# EAGLE schematic esp_teensy_bridge (EAGLE 9.6.2)
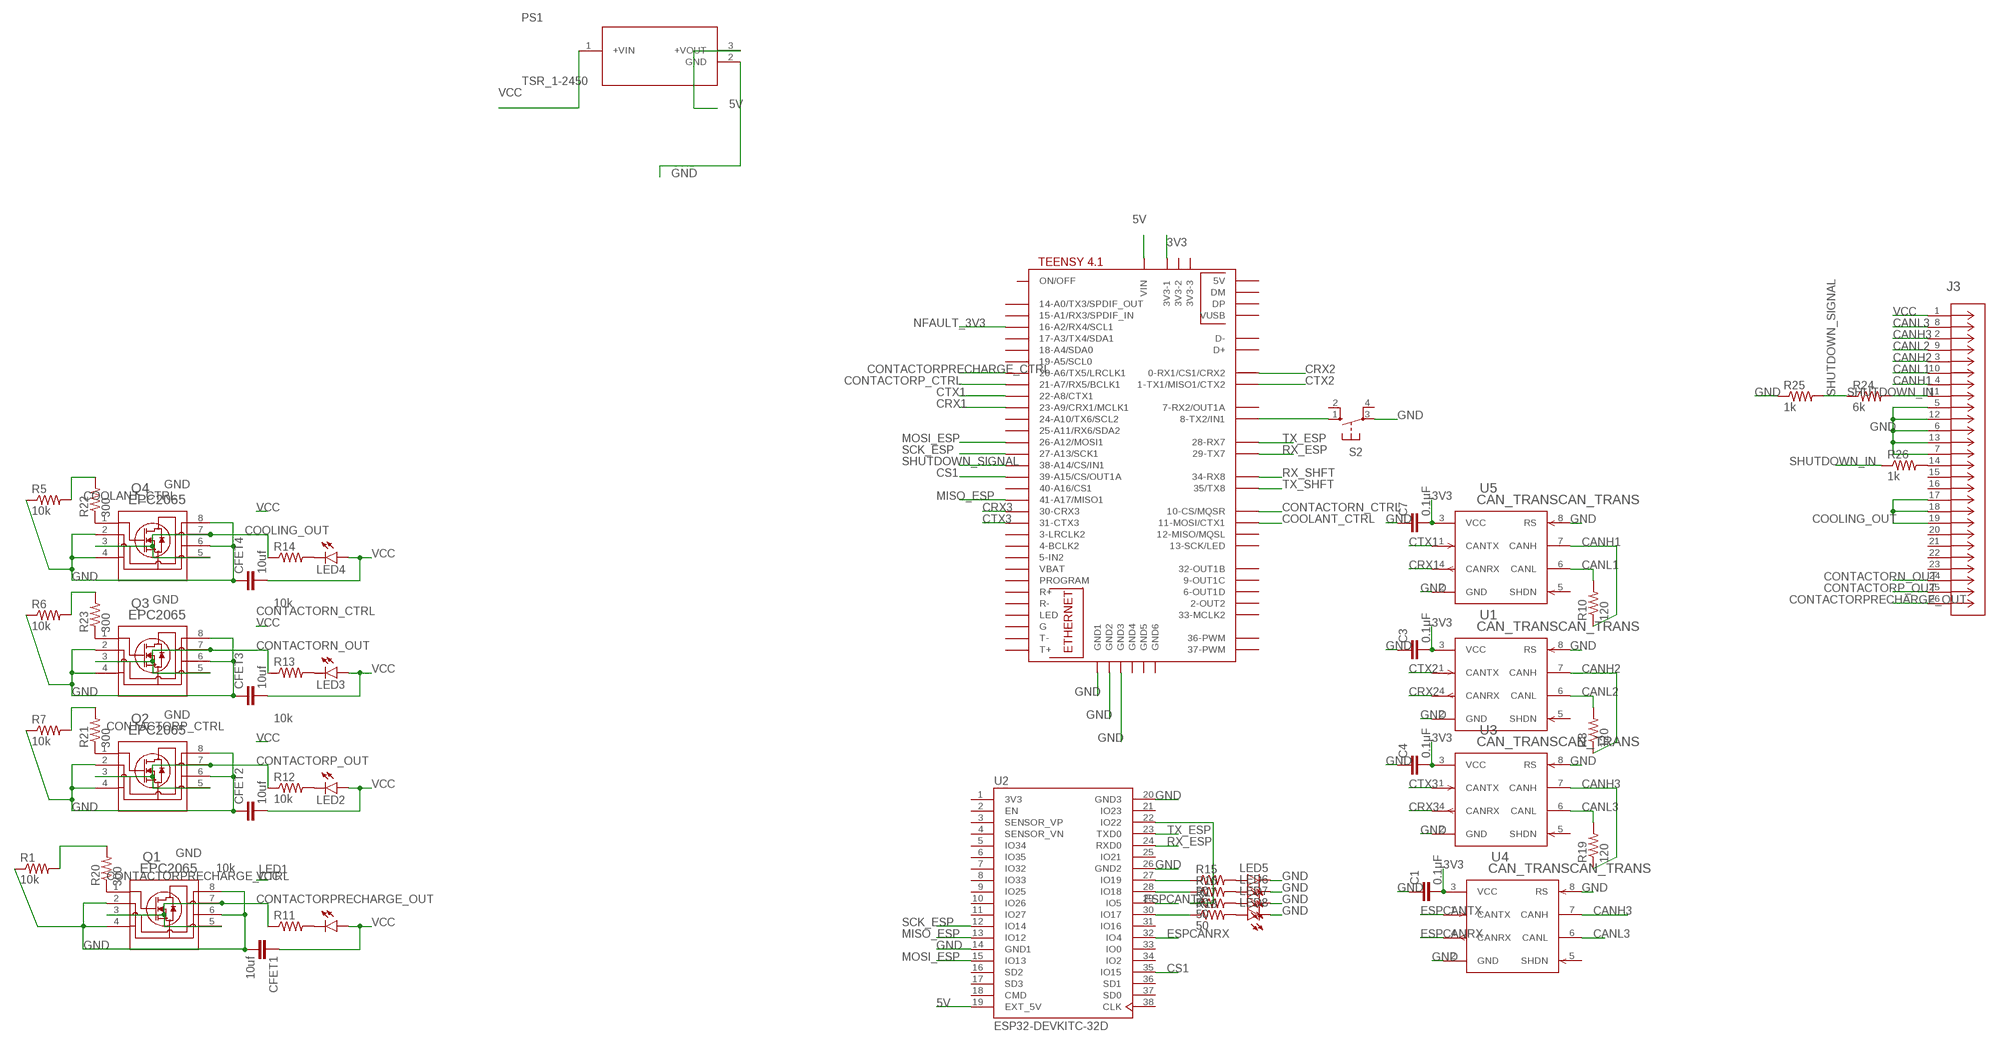
[diagram p0: schematic, sheet 1, part 1 of 2]
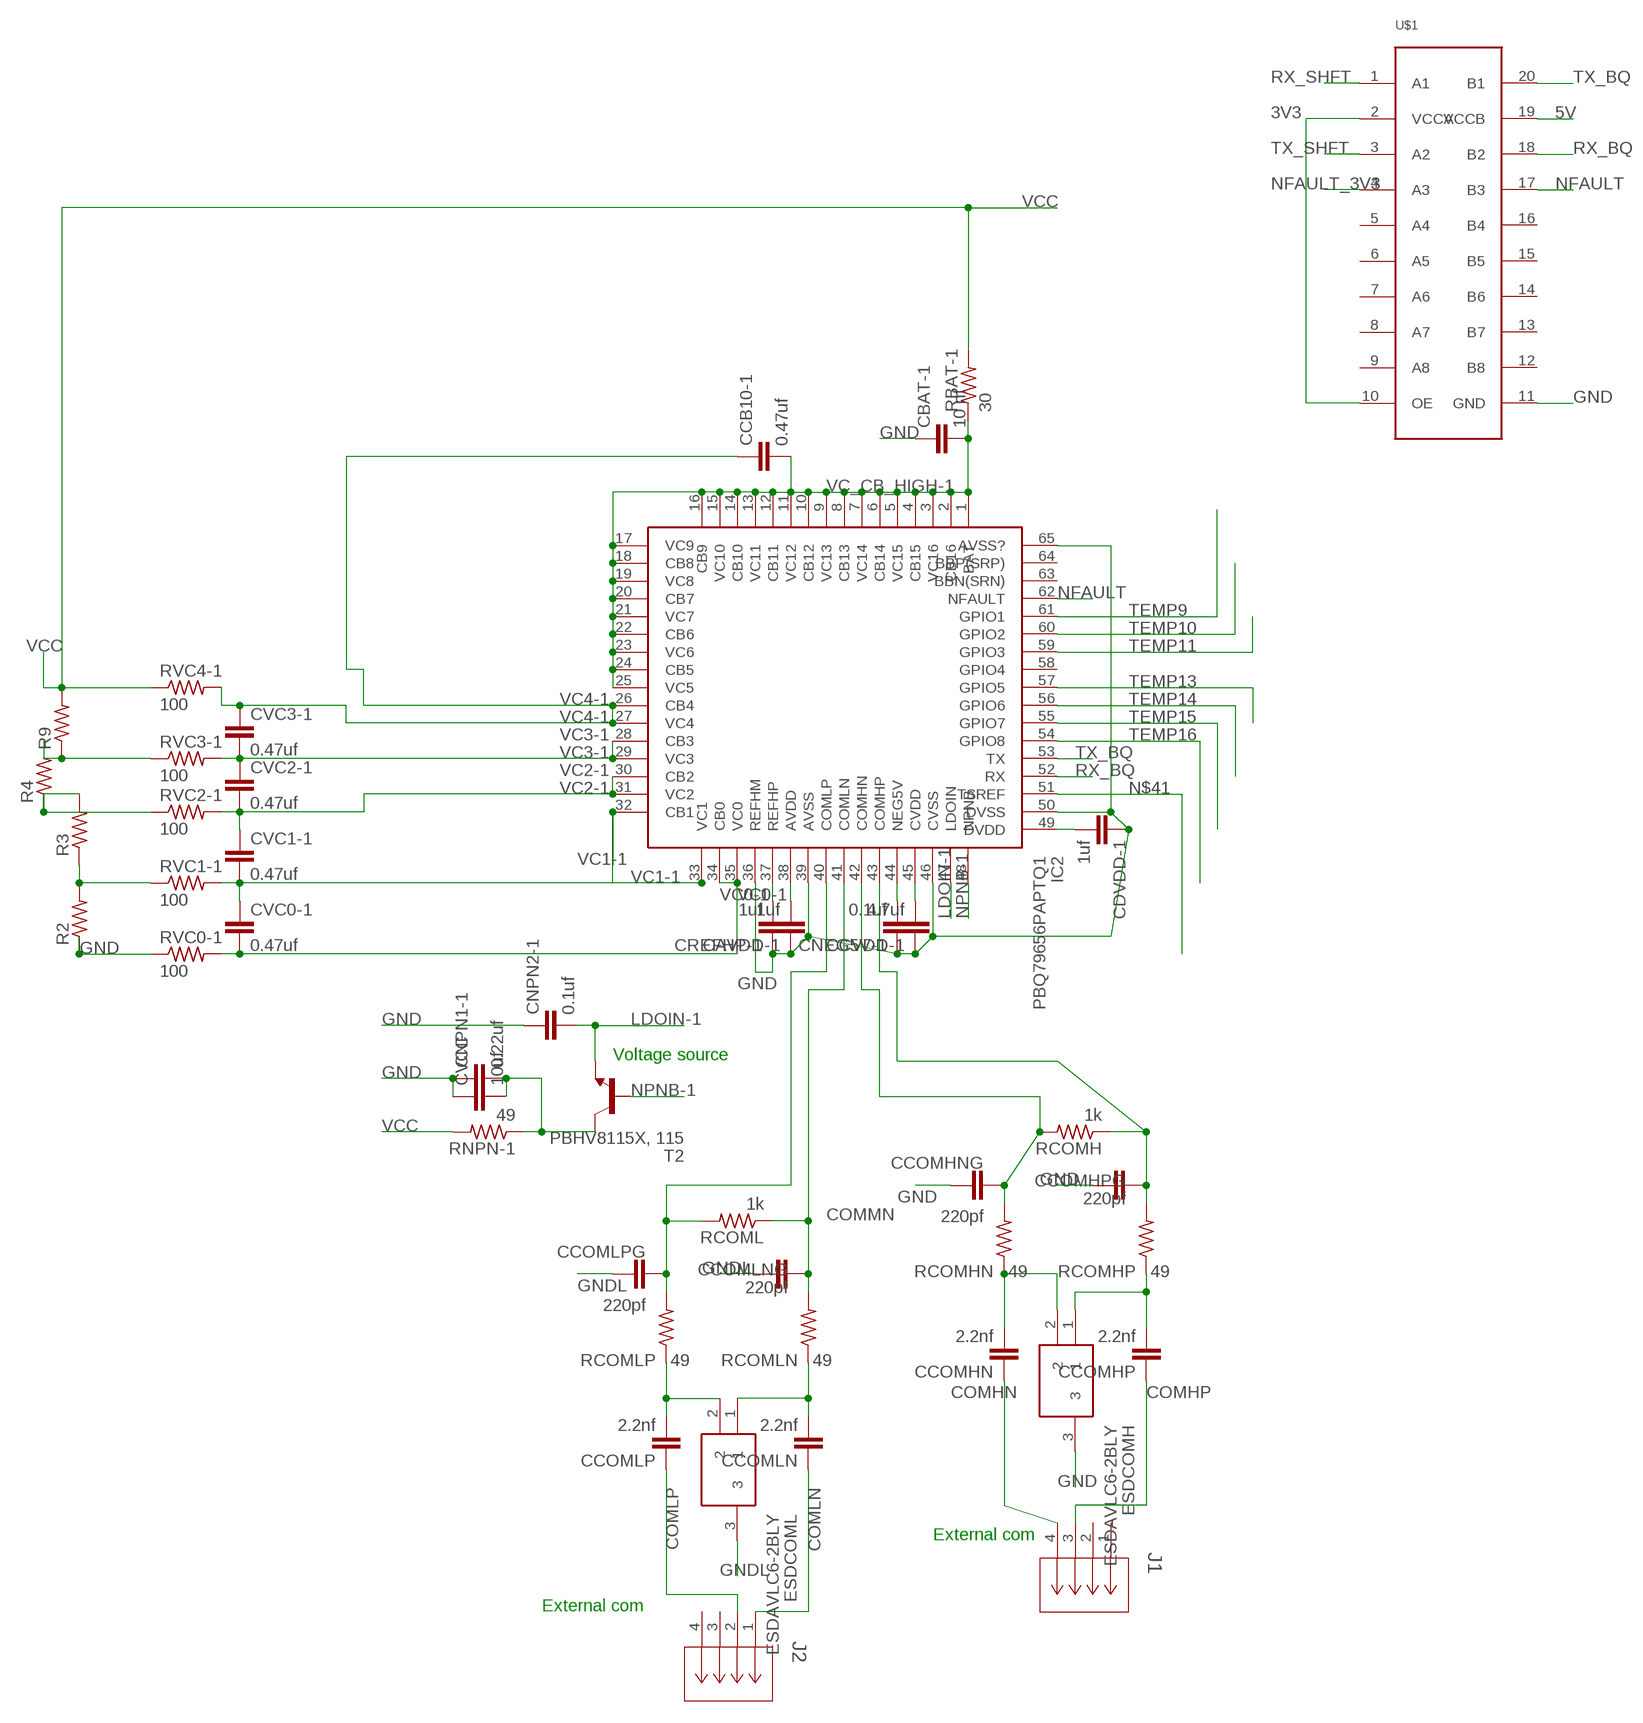
[diagram p1: schematic, sheet 1, part 2 of 2]

## Parts
C1  0.1μF  C-EUC0603  [C0603]
C3  0.1μF  C-EUC0603  [C0603]
C4  0.1μF  C-EUC0603  [C0603]
C7  0.1μF  C-EUC0603  [C0603]
CAVDD-1  1uf  C-EUC0603  [C0603]
CBAT-1  10 nf  C-EUC0603  [C0603]
CCB10-1  0.47uf  C-EUC0603  [C0603]
CCOMHN  2.2nf  C-EU075-032X103  [C075-032X103]
CCOMHNG  220pf  C-EUC0603  [C0603]
CCOMHP  2.2nf  C-EU075-032X103  [C075-032X103]
CCOMHPG  220pf  C-EUC0603  [C0603]
CCOMLN  2.2nf  C-EU075-032X103  [C075-032X103]
CCOMLNG  220pf  C-EUC0603  [C0603]
CCOMLP  2.2nf  C-EU075-032X103  [C075-032X103]
CCOMLPG  220pf  C-EUC0603  [C0603]
CCVDD-1  4.7uf  C-EUC0603  [C0603]
CDVDD-1  1uf  C-EUC0603  [C0603]
CFET1  10uf  C-EUC0805  [C0805]
CFET2  10uf  C-EUC0805  [C0805]
CFET3  10uf  C-EUC0805  [C0805]
CFET4  10uf  C-EUC0805  [C0805]
CNEG5V-1  0.1uf  C-EUC0603  [C0603]
CNPN1-1  0.22uf  C-EUC0603  [C0603]
CNPN2-1  0.1uf  C-EUC0603  [C0603]
CREFHP-1  1uf  C-EUC0603  [C0603]
CVC0-1  0.47uf  C-EUC0603  [C0603]
CVC1-1  0.47uf  C-EUC0603  [C0603]
CVC2-1  0.47uf  C-EUC0603  [C0603]
CVC3-1  0.47uf  C-EUC0603  [C0603]
CVCC  10uf  C-EUC0805  [C0805]
ESDCOMH  ESDAVLC6-2BLY  [SOT95P255X150-3N]
ESDCOML  ESDAVLC6-2BLY  [SOT95P255X150-3N]
IC2  PBQ79656PAPTQ1  [QFP50P1200X1200X120-65N]
J1  DF11-4DP-2DSA(24)  [CON4_2X2_UF_DF11_HIR]
J2  DF11-4DP-2DSA(24)  [CON4_2X2_UF_DF11_HIR]
J3  TE_AMP_SURESEAL_26  [CONN26_6473423-1_TEC]
LED1  LEDSML0603  [SML0603]
LED2  LEDSML0603  [SML0603]
LED3  LEDSML0603  [SML0603]
LED4  LEDSML0603  [SML0603]
LED5  LEDSML0603  [SML0603]
LED6  LEDSML0603  [SML0603]
LED7  LEDSML0603  [SML0603]
LED8  LEDSML0603  [SML0603]
PS1  TSR_1-2450  [TSR1-SINGLE_TRP]
Q1  EPC2065  [EPC2065_ECC]
Q2  EPC2065  [EPC2065_ECC]
Q3  EPC2065  [EPC2065_ECC]
Q4  EPC2065  [EPC2065_ECC]
R1  10k  R-US_R0603  [R0603]
R2  R-US_R0805  [R0805]
R3  R-US_R0805  [R0805]
R4  R-US_R0805  [R0805]
R5  10k  R-US_R0603  [R0603]
R6  10k  R-US_R0603  [R0603]
R7  10k  R-US_R0603  [R0603]
R8  120  R-US_R0603  [R0603]
R9  R-US_R0805  [R0805]
R10  120  R-US_R0603  [R0603]
R11  10k  R-US_R0603  [R0603]
R12  10k  R-US_R0603  [R0603]
R13  10k  R-US_R0603  [R0603]
R14  10k  R-US_R0603  [R0603]
R15  50  R-US_R0603  [R0603]
R16  50  R-US_R0603  [R0603]
R17  50  R-US_R0603  [R0603]
R18  50  R-US_R0603  [R0603]
R19  120  R-US_R0603  [R0603]
R20  300  R-US_R0603  [R0603]
R21  300  R-US_R0603  [R0603]
R22  300  R-US_R0603  [R0603]
R23  300  R-US_R0603  [R0603]
R24  6k  R-US_R0603  [R0603]
R25  1k  R-US_R0603  [R0603]
R26  1k  R-US_R0603  [R0603]
RBAT-1  30  R-US_R0603  [R0603]
RCOMH  1k  R-US_R0603  [R0603]
RCOMHN  49  R-US_R0603  [R0603]
RCOMHP  49  R-US_R0603  [R0603]
RCOML  1k  R-US_R0603  [R0603]
RCOMLN  49  R-US_R0603  [R0603]
RCOMLP  49  R-US_R0603  [R0603]
RNPN-1  49  R-US_R0603  [R0603]
RVC0-1  100  R-US_R0603  [R0603]
RVC1-1  100  R-US_R0603  [R0603]
RVC2-1  100  R-US_R0603  [R0603]
RVC3-1  100  R-US_R0603  [R0603]
RVC4-1  100  R-US_R0603  [R0603]
S2  10-XX  [B3F-10XX]
T2  PBHV8115X, 115  BC868-NPN-SOT89-BCE  [SOT89-BCE]
U1  CAN_TRANSCAN_TRANS  [MAX3051ESA+]
U2  ESP32-DEVKITC-32D  [MODULE_ESP32-DEVKITC-32D]
U3  CAN_TRANSCAN_TRANS  [MAX3051ESA+]
U4  CAN_TRANSCAN_TRANS  [MAX3051ESA+]
U5  CAN_TRANSCAN_TRANS  [MAX3051ESA+]
U$1  TXB0108PWSMD  [TSSOP20]
U$3  TEENSY41  [TEENSY41]

## Nets
3V3: C1.2 C3.2 C4.2 C7.2 U1.3(VCC) U3.3(VCC) U4.3(VCC) U5.3(VCC) U$1.2(VCCA) U$1.10(OE) U$3.3V3-1
5V: PS1.3(+VOUT) U2.19(EXT_5V) U$1.19(VCCB) U$3.VIN
CANH1: J3.4 R10.1 U5.7(CANH)
CANH2: J3.3 R8.1 U1.7(CANH)
CANH3: J3.2 R19.1 U3.7(CANH) U4.7(CANH)
CANL1: J3.10 R10.2 U5.6(CANL)
CANL2: J3.9 R8.2 U1.6(CANL)
CANL3: J3.8 R19.2 U3.6(CANL) U4.6(CANL)
COMHN: CCOMHN.1 J1.4
COMHP: CCOMHP.1 J1.3
COMLN: CCOMLN.1 J2.1
COMLP: CCOMLP.1 J2.2
CONTACTORN_CTRL: R6.2 R23.2 U$3.10-CS\MQSR(10-CS/MQSR)
CONTACTORN_OUT: J3.24 Q3.3 Q3.5 Q3.7 R13.1
CONTACTORP_CTRL: R7.2 R21.2 U$3.21-A7/RX5/BCLK1
CONTACTORP_OUT: J3.25 Q2.3 Q2.5 Q2.7 R12.1
CONTACTORPRECHARGE_CTRL: R1.2 R20.2 U$3.20-A6/TX5/LRCLK1
CONTACTORPRECHARGE_OUT: J3.26 Q1.3 Q1.5 Q1.7 R11.1
COOLANT_CTRL: R5.2 R22.2 U$3.11-MOSI/CTX1
COOLING_OUT: J3.17 J3.18 J3.19 Q4.3 Q4.5 Q4.7 R14.1
CRX1: U5.4(CANRX) U$3.23-A9/CRX1/MCLK1
CRX2: U1.4(CANRX) U$3.0-RX1/CS1/CRX2
CRX3: U3.4(CANRX) U$3.30-CRX3
CS1: U2.35(IO15) U$3.39-A15/CS/OUT1A
CTX1: U5.1(CANTX) U$3.22-A8/CTX1
CTX2: U1.1(CANTX) U$3.1-TX1/MISO1/CTX2
CTX3: U3.1(CANTX) U$3.31-CTX3
CVDD-1: CCVDD-1.2 IC2.45(CVDD)
ESPCANRX: U2.32(IO4) U4.4(CANRX)
ESPCANTX: U2.29(IO5) U4.1(CANTX)
GND: C1.1 C3.1 C4.1 C7.1 CAVDD-1.1 CBAT-1.1 CCOMHNG.1 CCOMHPG.1 CCVDD-1.1 CDVDD-1.1 CFET1.2 CFET2.1 CFET3.1 CFET4.1 CNEG5V-1.1 CNPN1-1.1 CNPN2-1.1 CREFHP-1.1 CVCC.1 ESDCOMH.3 IC2.36(REFHM) IC2.39(AVSS) IC2.46(CVSS) IC2.50(DVSS) IC2.65(AVSS?) J3.5 J3.6 J3.7 J3.12 J3.13 LED5.C LED6.C LED7.C LED8.C PS1.2(GND) Q1.2 Q1.4 Q1.6 Q1.8 Q2.2 Q2.4 Q2.6 Q2.8 Q3.2 Q3.4 Q3.6 Q3.8 Q4.2 Q4.4 Q4.6 Q4.8 R1.1 R2.1 R5.1 R6.1 R7.1 R25.1 RVC0-1.1 S2.3(P) U1.2(GND) U1.8(RS) U2.14(GND1) U2.20(GND3) U2.26(GND2) U3.2(GND) U3.8(RS) U4.2(GND) U4.8(RS) U5.2(GND) U5.8(RS) U$1.11(GND) U$3.GND1 U$3.GND2 U$3.GND3
GNDL: CCOMLNG.1 CCOMLPG.1 ESDCOML.3
LDOIN-1: CNPN2-1.2 IC2.47(LDOIN) T2.E
MISO_ESP: U2.13(IO12) U$3.41-A17/MISO1
MOSI_ESP: U2.15(IO13) U$3.26-A12/MOSI1
N$1: CCOMHP.2 ESDCOMH.1 RCOMHP.1
N$2: J3.14 R26.2
N$3: LED4.C R14.2
N$4: LED3.C R13.2
N$7: S2.1(S) U$3.8-TX2/IN1
N$8: CCOMHN.2 ESDCOMH.2 RCOMHN.1
N$9: LED2.C R12.2
N$10: CCOMLNG.2 IC2.41(COMLN) RCOML.1 RCOMLN.2
N$11: R17.1 U2.22(IO22)
N$13: LED1.C R11.2
N$15: Q1.1 R20.1
N$16: Q2.1 R21.1
N$28: R15.1 U2.27(IO19)
N$29: R16.1 U2.28(IO18)
N$30: Q3.1 R23.1
N$31: R18.1 U2.30(IO17)
N$32: LED5.A R15.2
N$33: LED6.A R16.2
N$34: LED7.A R17.2
N$35: LED8.A R18.2
N$36: Q4.1 R22.1
N$41: IC2.51(TSREF)
N$49: CCOMLPG.2 IC2.40(COMLP) RCOML.2 RCOMLP.2
N$67: CCOMLP.2 ESDCOML.2 RCOMLP.1
N$68: CCOMLN.2 ESDCOML.1 RCOMLN.1
N$72: R3.2 R4.1 RVC2-1.1
N$73: R2.2 R3.1 RVC1-1.1
N$75: R4.2 R9.1 RVC3-1.1
N$111: CREFHP-1.2 IC2.37(REFHP)
N$112: CAVDD-1.2 IC2.38(AVDD)
N$113: CNEG5V-1.2 IC2.44(NEG5V)
N$114: CDVDD-1.2 IC2.49(DVDD)
N$130: CNPN1-1.2 CVCC.2 RNPN-1.1 T2.C
N$131: CCOMHPG.2 IC2.43(COMHP) RCOMH.1 RCOMHP.2
N$132: CCOMHNG.2 IC2.42(COMHN) RCOMH.2 RCOMHN.2
NFAULT: IC2.62(NFAULT) U$1.17(B3)
NFAULT_3V3: U$1.4(A3) U$3.16-A2/RX4/SCL1
NPNB-1: IC2.48(NPNB) T2.B
RX_BQ: IC2.52(RX) U$1.18(B2)
RX_ESP: U2.24(RXD0) U$3.29-TX7
RX_SHFT: U$1.1(A1) U$3.34-RX8
SCK_ESP: U2.12(IO14) U$3.27-A13/SCK1
SHUTDOWN_IN: J3.11 R24.2 R26.1
SHUTDOWN_SIGNAL: R24.1 R25.2 U$3.38-A14/CS/IN1
TEMP9: IC2.61(GPIO1)
TEMP10: IC2.60(GPIO2)
TEMP11: IC2.59(GPIO3)
TEMP13: IC2.57(GPIO5)
TEMP14: IC2.56(GPIO6)
TEMP15: IC2.55(GPIO7)
TEMP16: IC2.54(GPIO8)
TX_BQ: IC2.53(TX) U$1.20(B1)
TX_ESP: U2.23(TXD0) U$3.28-RX7
TX_SHFT: U$1.3(A2) U$3.35-TX8(35/TX8)
VC0-1: CVC0-1.2 IC2.34(CB0) IC2.35(VC0) RVC0-1.2
VC1-1: CVC0-1.1 CVC1-1.2 IC2.32(CB1) IC2.33(VC1) RVC1-1.2
VC2-1: CVC1-1.1 CVC2-1.2 IC2.30(CB2) IC2.31(VC2) RVC2-1.2
VC3-1: CVC2-1.1 CVC3-1.2 IC2.28(CB3) IC2.29(VC3) RVC3-1.2
VC4-1: CCB10-1.1 CVC3-1.1 IC2.26(CB4) IC2.27(VC4) RVC4-1.2
VC_CB_HIGH-1: CBAT-1.2 CCB10-1.2 IC2.1(BAT) IC2.2(CB16) IC2.3(VC16) IC2.4(CB15) IC2.5(VC15) IC2.6(CB14) IC2.7(VC14) IC2.8(CB13) IC2.9(VC13) IC2.10(CB12) IC2.11(VC12) IC2.12(CB11) IC2.13(VC11) IC2.14(CB10) IC2.15(VC10) IC2.16(CB9) IC2.17(VC9) IC2.18(CB8) IC2.19(VC8) IC2.20(CB7) IC2.21(VC7) IC2.22(CB6) IC2.23(VC6) IC2.24(CB5) IC2.25(VC5) RBAT-1.1
VCC: CFET1.1 CFET2.2 CFET3.2 CFET4.2 J3.1 LED1.A LED2.A LED3.A LED4.A PS1.1(+VIN) R9.2 RBAT-1.2 RNPN-1.2 RVC4-1.1
Unconnected: IC2.58(GPIO4) IC2.63(BBN(SRN)) IC2.64(BBP(SRP)) J1.1 J1.2 J2.3 J2.4 J3.15 J3.16 J3.20 J3.21 J3.22 J3.23 S2.2(S1) S2.4(P1) U1.5(SHDN) U2.2(EN) U2.3(SENSOR_VP) U2.4(SENSOR_VN) U2.5(IO34) U2.6(IO35) U2.7(IO32) U2.8(IO33) U2.9(IO25) U2.10(IO26) U2.11(IO27) U2.16(SD2) U2.17(SD3) U2.18(CMD) U2.21(IO23) U2.25(IO21) U2.31(IO16) U2.33(IO0) U2.34(IO2) U2.36(SD1) U2.37(SD0) U2.38(CLK) U3.5(SHDN) U4.5(SHDN) U5.5(SHDN) U$1.5(A4) U$1.6(A5) U$1.7(A6) U$1.8(A7) U$1.9(A8) U$1.12(B8) U$1.13(B7) U$1.14(B6) U$1.15(B5) U$1.16(B4) U$3.2-OUT2 U$3.3-LRCLK2 U$3.3V3-2 U$3.3V3-3 U$3.4-BCLK2 U$3.5-IN2 U$3.6-OUT1D U$3.7-RX2/OUT1A U$3.9-OUT1C U$3.12-MISO/MQSL U$3.13-SCK/LED U$3.14-A0/TX3/SPDIF_OUT U$3.15-A1/RX3/SPDIF_IN U$3.17-A3/TX4/SDA1 U$3.18-A4/SDA0 U$3.19-A5/SCL0 U$3.24-A10/TX6/SCL2 U$3.25-A11/RX6/SDA2 U$3.32-OUT1B U$3.33-MCLK2 U$3.36-PWM U$3.37-PWM U$3.40-A16/CS1 U$3.+5V(5V) U$3.D+ U$3.D- U$3.DM U$3.DP U$3.G U$3.GND4 U$3.GND5 U$3.GND6 U$3.LED U$3.ON/OFF U$3.PROGRAM U$3.R+ U$3.R- U$3.T+ U$3.T- U$3.VBAT U$3.VUSB

## Notes on the sheet
- Voltage source
- External com
- External com

## Power pins joined to a net without a drawn wire
3V3: U2.1(3V3)

## Library data of the parts
C1 C3 C4 C7 CAVDD-1 CBAT-1 CCB10-1 CCOMHN CCOMHNG CCOMHP CCOMHPG CCOMLN CCOMLNG CCOMLP CCOMLPG CCVDD-1 CDVDD-1 CFET1-CFET4 CNEG5V-1 CNPN1-1 CNPN2-1 CREFHP-1 CVC0-1 CVC1-1 CVC2-1 CVC3-1 CVCC = rcl:C-EU: CAPACITOR, European symbol; SPICEPREFIX: C
ESDCOMH ESDCOML = ESDAVLC6-2BLY:ESDAVLC6-2BLY: STMICROELECTRONICS - ESDAVLC6-2BLY - ESD Protection Device, 17 V, SOT-23, 3 Pins, 5 V, 140 W, ESDA Transil Series Source: Datasheet <http://www.st.com/resource/en/datasheet/esdavlc6-2bly.pdf>; DESCRIPTION: STMICROELECTRONICS - ESDAVLC6-2BLY - ESD Protection Device, 17 V, SOT-23, 3 Pins, 5 V, 140 W, ESDA Transil Series; HEIGHT: 1.5mm; MANUFACTURER_NAME: STMicroelectronics; MANUFACTURER_PART_NUMBER: ESDAVLC6-2BLY; MOUSER_PART_NUMBER: 511-ESDAVLC6-2BLY; MOUSER_PRICE-STOCK: https://www.mouser.co.uk/ProductDetail/STMicroelectronics/ESDAVLC6-2BLY?qs=l7cgNqFNU1iH2e21evvYsA%3D%3D
IC2 = PBQ79656PAPTQ1:PBQ79656PAPTQ1: BQ7965x-Q1 Family of 12S, 14S, 16S Precision Automotive Battery Monitor, Balancer and Integrated Hardware Protector with up to SafeTITM-26262 ASIL-D Compliance Source: Datasheet <http://www.ti.com/lit/ds/symlink/bq79616-q1.pdf>; DESCRIPTION: BQ7965x-Q1 Family of 12S, 14S, 16S Precision Automotive Battery Monitor, Balancer and Integrated Hardware Protector with up to SafeTITM-26262 ASIL-D Compliance; HEIGHT: 1.2mm; MANUFACTURER_NAME: Texas Instruments; MANUFACTURER_PART_NUMBER: PBQ79656PAPTQ1
J1 J2 = hirose_connectors:DF11-4DP-2DSA(24); COPYRIGHT: Copyright (C) 2023 Ultra Librarian. All rights reserved.; DIGI-KEY_PART_NUMBER_1: H10229-ND; MANUFACTURER_PART_NUMBER: DF11-4DP-2DSA(24); MFR_NAME: Hirose
J3 = TE_Sureseal:TE_AMP_SURESEAL_26; COPYRIGHT: Copyright (C) 2023 Ultra Librarian. All rights reserved.; DIGIKEY_PART_NUMBER_1: 6473423-1-ND; MANUFACTURER_PART_NUMBER: 6473423-1; MFR_NAME: TE Connectivity
LED1-LED8 = led:LED: LED OSRAM: - CHIPLED LG R971, LG N971, LY N971, LG Q971, LY Q971, LO R971, LY R971 LH N974, LH R974 LS Q976, LO Q976, LY Q976 LO Q996 - Hyper CHIPLED LW Q18S LB Q993, LB Q99A, LB R99A - SideLED LS A670, LO A670, LY A670, LG A670, LP A670 LB A673, LV A673, LT A673, LW A673 LH A674 LY A675 LS A676, LA A676, LO A676, LY A676, LW A676 LS A679, LY A679, LG A679 - Hyper Micro SIDELED® LS Y876, LA Y876, LO Y876, LY Y876 LT Y87S - SmartLED LW L88C, LW L88S LB L89C, LB L89S, LG L890 LS L89K, LO L89K, LY L89K LS L896, LA L896, LO L896, LY L896 - TOPLED LS T670, LO T670, LY T670, LG T670, LP T670 LSG T670, LSP T670, LSY T670, LOP T670, LYG T670 LG T671, LOG T671, LSG T671 LB T673, LV T673, LT T673, LW T673 LH T674 LS T676, LA T676, LO T676, LY T676, LB T676, LH T676, LSB T676, LW T676 LB T67C, LV T67C, LT T67C, LS T67K, LO T67K, LY T67K, LW E67C LS E67B, LA E67B, LO E67B, LY E67B, LB E67C, LV E67C, LT E67C LW T67C LS T679, LY T679, LG T679 LS T770, LO T770, LY T770, LG T770, LP T770 LB T773, LV T773, LT T773, LW T773 LH T774 LS E675, LA E675, LY E675, LS T675 LS T776, LA T776, LO T776, LY T776, LB T776 LHGB T686 LT T68C, LB T68C - Hyper Mini TOPLED® LB M676 - Mini TOPLED Santana® LG M470 LS M47K, LO M47K, LY M47K Source: http://www.osram.convergy.de LUXEON: - LUMILED® LXK2-PW12-R00, LXK2-PW12-S00, LXK2-PW14-U00, LXK2-PW14-V00 LXK2-PM12-R00, LXK2-PM12-S00, LXK2-PM14-U00 LXK2-PE12-Q00, LXK2-PE12-R00, LXK2-PE12-S00, LXK2-PE14-T00, LXK2-PE14-U00 LXK2-PB12-K00, LXK2-PB12-L00, LXK2-PB12-M00, LXK2-PB14-N00, LXK2-PB14-P00, LXK2-PB14-Q00 LXK2-PR12-L00, LXK2-PR12-M00, LXK2-PR14-Q00, LXK2-PR14-R00 LXK2-PD12-Q00, LXK2-PD12-R00, LXK2-PD12-S00 LXK2-PH12-R00, LXK2-PH12-S00 LXK2-PL12-P00, LXK2-PL12-Q00, LXK2-PL12-R00 Source: www.luxeon.com KINGBRIGHT: KA-3528ASYC Source: www.kingbright.com
PS1 = dcdc_5v:TSR_1-2450; COPYRIGHT: Copyright (C) 2023 Ultra Librarian. All rights reserved.; DIGI-KEY_PART_NUMBER_1: 1951-2747-ND; MANUFACTURER_PART_NUMBER: TSR 1-2450; MFR_NAME: Traco Power
Q1-Q4 = EPCGaNFET:EPC2065; COPYRIGHT: Copyright (C) 2023 Ultra Librarian. All rights reserved.; DIGIKEY_PART_NUMBER_1: 917-EPC2065TR-ND; DIGIKEY_PART_NUMBER_2: 917-EPC2065CT-ND; DIGIKEY_PART_NUMBER_3: 917-EPC2065DKR-ND; MANUFACTURER_PART_NUMBER: EPC2065; MFR_NAME: EPC
R1-R26 RBAT-1 RCOMH RCOMHN RCOMHP RCOML RCOMLN RCOMLP RNPN-1 RVC0-1 RVC1-1 RVC2-1 RVC3-1 RVC4-1 = rcl:R-US_: RESISTOR, American symbol; SPICEPREFIX: R
S2 = switch-omron:10-XX: OMRON SWITCH; MPN: B3F-1000; OC_FARNELL: 176432; OC_NEWARK: 36M3542
T2 = transistor:*-NPN-: NPN Transistror BF959 corrected 2008.03.06
U1 U3-U5 = NFR23_v1.1:CAN_TRANS; COPYRIGHT: Copyright (C) 2022 Ultra Librarian. All rights reserved.; DIGI-KEY_PART_NUMBER_1: MAX3051ESA+-ND; MANUFACTURER_PART_NUMBER: MAX3051ESA+; MFR_NAME: Maxim Integrated Products
U2 = ESP32-DEVKITC-32D:ESP32-DEVKITC-32D: Eval Board For Esp-Wroom-32 Check availability <https://pricing.snapeda.com/parts/ESP32-DEVKITC-32D/Espressif%20Systems/view-part?ref=eda>; AVAILABILITY: In Stock; DESCRIPTION: WiFi Development Tools (802.11) ESP32 General Development Kit, ESP32-WROOM-32D on the board; MF: Espressif Systems; MP: ESP32-DEVKITC-32D; PACKAGE: None; PRICE: None; PURCHASE-URL: https://pricing.snapeda.com/search/part/ESP32-DEVKITC-32D/?ref=eda
U$1 = TB0108:TXB0108PW
U$3 = teensy:TEENSY41